# Altium schematic sheet LAB2.SchDoc: CAN-to-CAN
size A3; Revision: PW-Test-Lab2; PageSetup: Record=PageOptions|CenterHorizontal=True|CenterVertical=True|PrintScale=0.71|XCorrection=1.00|YCorrection=1.00|PrintKind=1|BorderSize=5000000|LeftOffset=0|BottomOffset=0|Orientation=2|PaperLength=2970|PaperWidth=2100|Scale=100|PaperSource=7|PrintQuality=1200|MediaType=1|DitherType=10|PaperKind=A4|PrintScaleMode=1
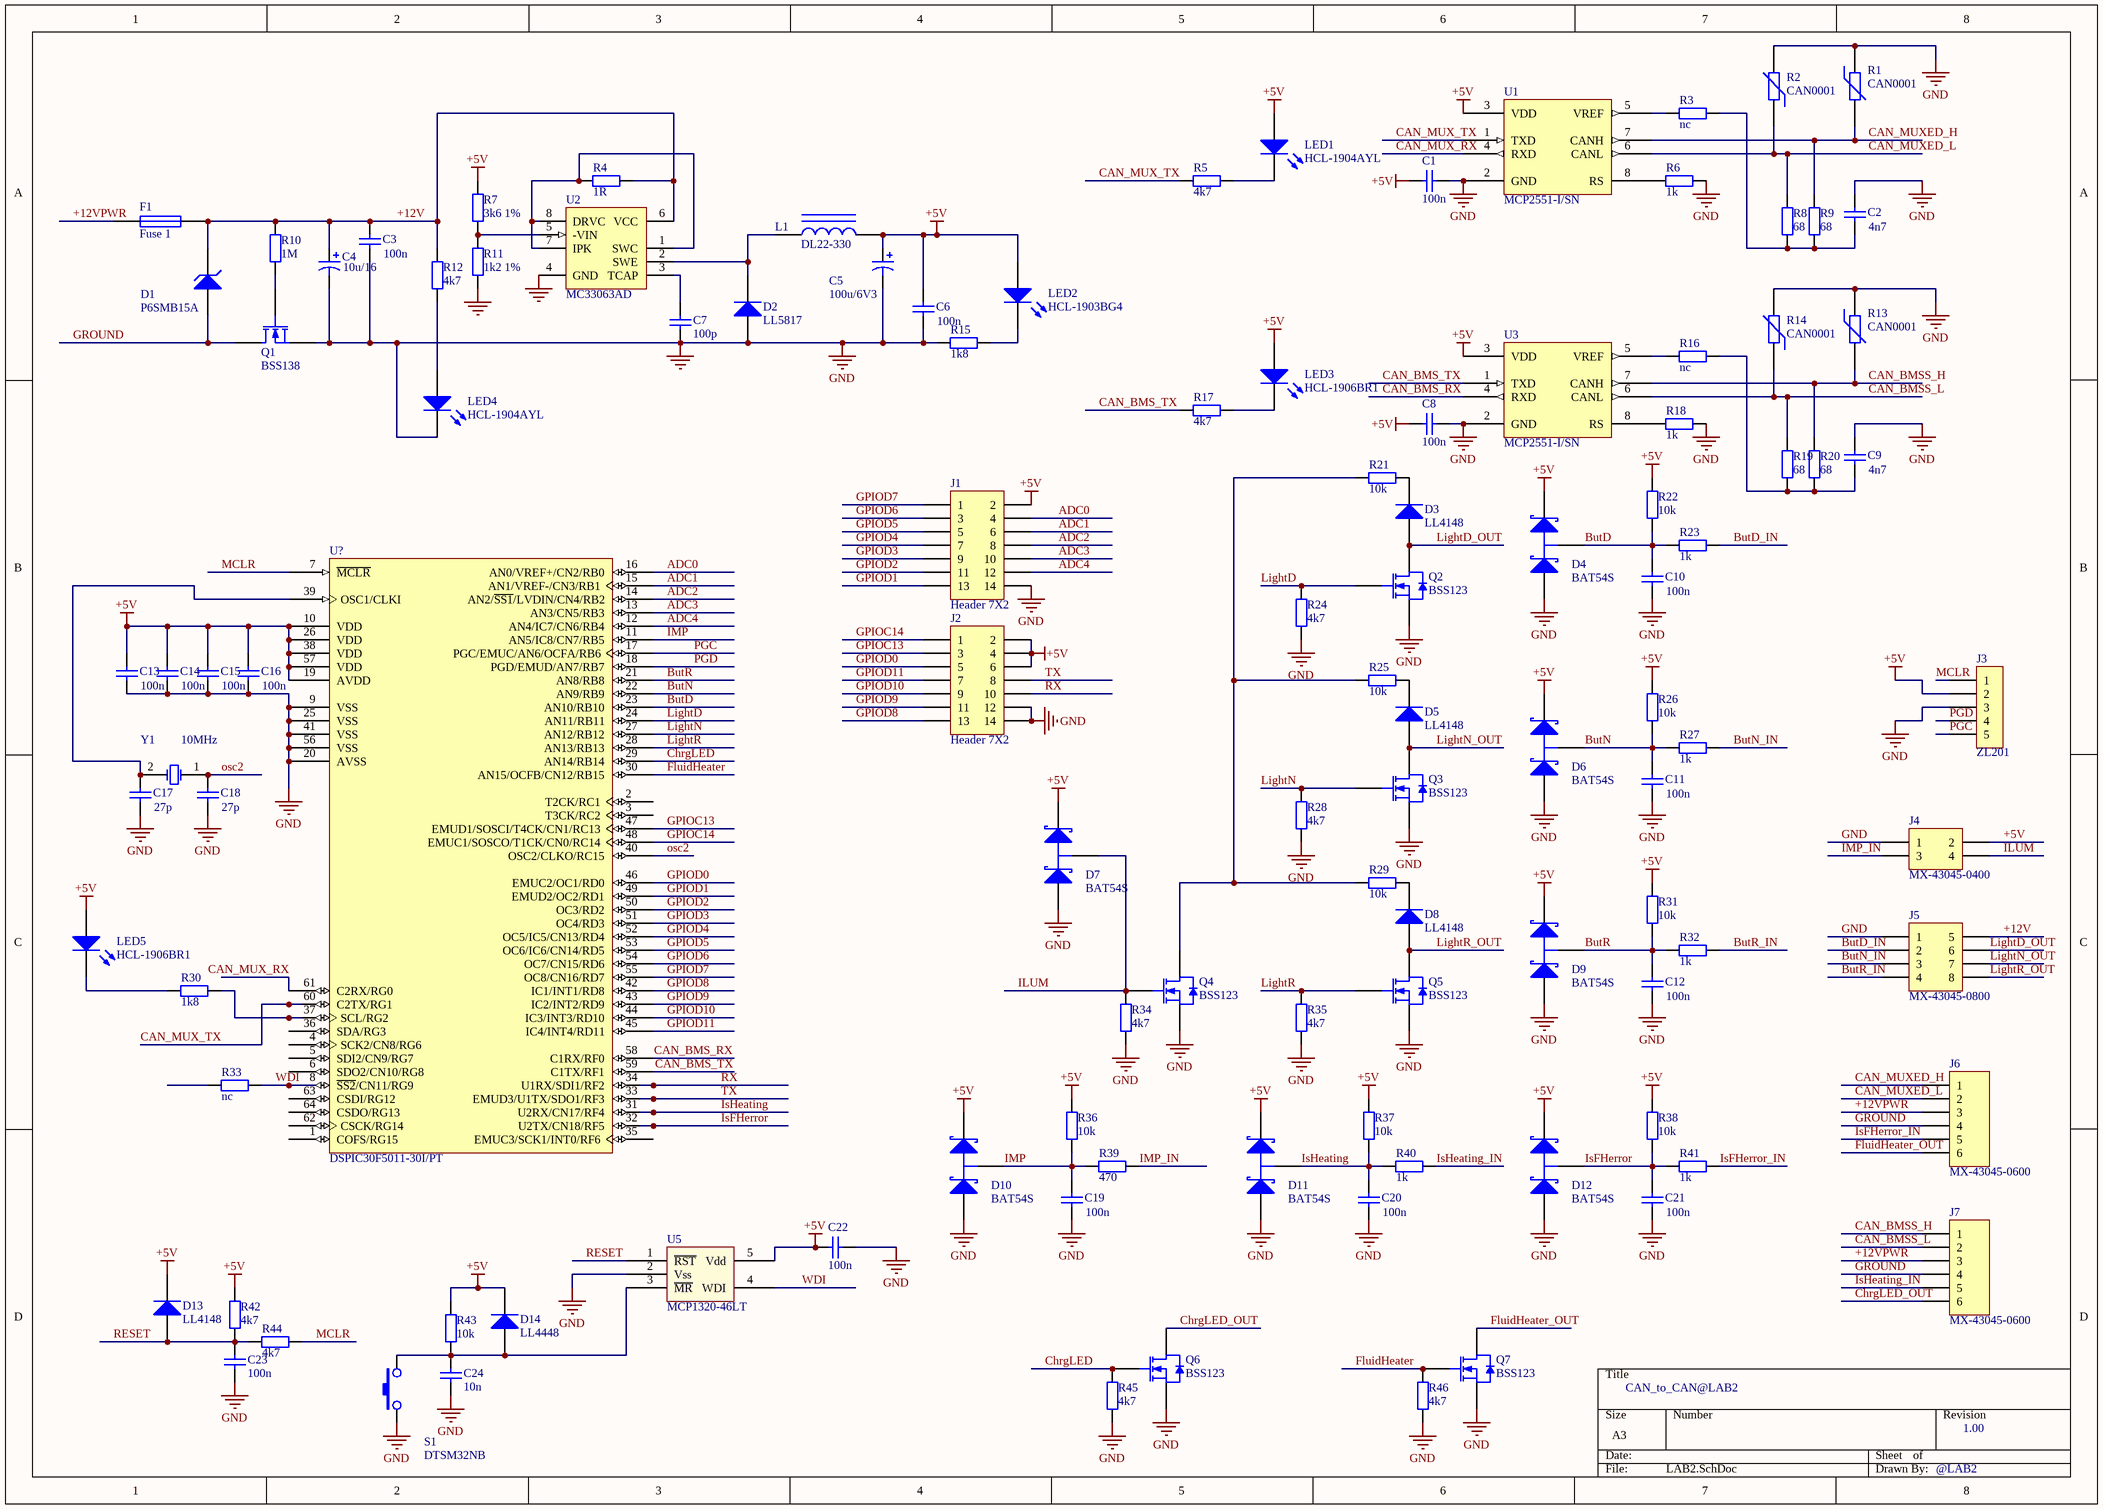
[diagram p0: LAB2.SchDoc]

## Parts
C1  100n  [0603]
C2  4n7  [0603]
C3  100n  [0805]
C4  10u/16  [CAP B]
C5  100u/6V3  [CAP B]
C6  100n  [0603]
C7  100p  [0603]
C8  100n  [0603]
C9  4n7  [0603]
C10  100n  [0603]
C11  100n  [0603]
C12  100n  [0603]
C13  100n  [0603]
C14  100n  [0603]
C15  100n  [0603]
C16  100n  [0603]
C17  27p  [0603]
C18  27p  [0603]
C19  100n  [0603]
C20  100n  [0603]
C21  100n  [0603]
C22  100n  [0603]
C23  100n  [0603]
C24  10n  [0603]
D1  P6SMB15A  [SMB]
D2  LL5817  [MELF]
D3  LL4148  [MINIMELF]
D4  BAT54S  [SOT-23]
D5  LL4148  [MINIMELF]
D6  BAT54S  [SOT-23]
D7  BAT54S  [SOT-23]
D8  LL4148  [MINIMELF]
D9  BAT54S  [SOT-23]
D10  BAT54S  [SOT-23]
D11  BAT54S  [SOT-23]
D12  BAT54S  [SOT-23]
D13  LL4148  [MINIMELF]
D14  LL4448  [MINIMELF]
F1  Fuse 1  [1812]
J1  Header 7X2  [HDR2X7]
J2  Header 7X2  [HDR2X7]
J3  ZL201  [HDR1X5]
J4  MX-43045-0400  [FP-43045-0400-MFG]
J5  MX-43045-0800  [MOLEX2X4]
J6  MX-43045-0600  [MOLEX2X3]
J7  MX-43045-0600  [MOLEX2X3]
L1  DL22-330  [DL22]
LED1  HCL-1904AYL  [0603]
LED2  HCL-1903BG4  [0603]
LED3  HCL-1906BR1  [0603]
LED4  HCL-1904AYL  [0603]
LED5  HCL-1906BR1  [0603]
Q1  BSS138  [SOT23]
Q2  BSS123  [SOT23]
Q3  BSS123  [SOT23]
Q4  BSS123  [SOT23]
Q5  BSS123  [SOT23]
Q6  BSS123  [SOT23]
Q7  BSS123  [SOT23]
R1  CAN0001  [0603]
R2  CAN0001  [0603]
R3  nc  [0603]
R4  1R  [0805]
R5  4k7  [0603]
R6  1k  [0603]
R7  3k6 1%  [0603]
R8  68  [0603]
R9  68  [0603]
R10  1M  [0603]
R11  1k2 1%  [0603]
R12  4k7  [0603]
R13  CAN0001  [0603]
R14  CAN0001  [0603]
R15  1k8  [0603]
R16  nc  [0603]
R17  4k7  [0603]
R18  1k  [0603]
R19  68  [0603]
R20  68  [0603]
R21  10k  [0603]
R22  10k  [0603]
R23  1k  [0603]
R24  4k7  [0603]
R25  10k  [0603]
R26  10k  [0603]
R27  1k  [0603]
R28  4k7  [0603]
R29  10k  [0603]
R30  1k8  [0603]
R31  10k  [0603]
R32  1k  [0603]
R33  nc  [0603]
R34  4k7  [0603]
R35  4k7  [0603]
R36  10k  [0603]
R37  10k  [0603]
R38  10k  [0603]
R39  470  [0603]
R40  1k  [0603]
R41  1k  [0603]
R42  4k7  [0603]
R43  10k  [0603]
R44  4k7  [0603]
R45  4k7  [0603]
R46  4k7  [0603]
S1  DTSM32NB  [DTSM31N]
U1  MCP2551-I/SN  [MCHP-SN8_V]
U2  MC33063AD  [SO8_N]
U3  MCP2551-I/SN  [MCHP-SN8_V]
U5  MCP1320-46LT  [SOT-23-OT5_L]
U?  DSPIC30F5011-30I/PT  [TQFP-PT64_L]
Y1  10MHz  [XTALSMD2]

## Nets
+5V: C1.1 C5.1 C6.1 C8.1 C13.1 C14.1 C15.1 C16.1 C22.1 D4.2(K) D6.2(K) D7.2(K) D9.2(K) D10.2(K) D11.2(K) D12.2(K) D13.2(K) D14.2(K) J1.2 J2.2 J2.4 J2.6 J3.2 J4.2 L1.2 LED1.1(A) LED2.1(A) LED3.1(A) LED5.1(A) R7.1 R22.1 R26.1 R31.1 R36.1 R37.1 R38.1 R42.1 R43.2 U1.3(VDD) U3.3(VDD) U5.5(Vdd) U?.10(VDD) U?.19(AVDD) U?.26(VDD) U?.38(VDD) U?.57(VDD)
GND: C1.2 C2.1 C3.2 C4.2 C5.2 C6.2 C7.1 C8.2 C9.1 C10.2 C11.2 C12.2 C13.2 C14.2 C15.2 C16.2 C17.2 C18.2 C19.2 C20.2 C21.2 C22.2 C23.1 C24.1 D2.1(A) D4.1(A) D6.1(A) D7.1(A) D9.1(A) D10.1(A) D11.1(A) D12.1(A) J1.14 J2.12 J2.14 J3.3 J4.1 J5.1 LED4.2(K) Q1.2(S) Q2.2(S) Q3.2(S) Q4.2(S) Q5.2(S) Q6.2(S) Q7.2(S) R1.1 R2.2 R6.2 R11.1 R13.1 R14.2 R15.2 R18.2 R24.2 R28.2 R34.2 R35.2 R45.2 R46.2 S1.1 U1.2(GND) U2.4(GND) U3.2(GND) U5.2(Vss) U?.9(VSS) U?.20(AVSS) U?.25(VSS) U?.41(VSS) U?.56(VSS)
+12V: C3.1 C4.1 D1.2(K) F1.2 J5.5 R4.2 R10.1 R12.1 U2.6(VCC)
+12VPWR: F1.1 J6.3 J7.3
ADC0: J1.4 U?.16(AN0/VREF+/CN2/RB0)
ADC1: J1.6 U?.15(AN1/VREF-/CN3/RB1)
ADC2: J1.8 U?.14(AN2/~{SS1}/LVDIN/CN4/RB2)
ADC3: J1.10 U?.13(AN3/CN5/RB3)
ADC4: J1.12 U?.12(AN4/IC7/CN6/RB4)
ButD: C10.1 D4.3(C) R22.2 R23.2 U?.23(AN10/RB10)
ButD_IN: J5.2 R23.1
ButN: C11.1 D6.3(C) R26.2 R27.2 U?.22(AN9/RB9)
ButN_IN: J5.3 R27.1
ButR: C12.1 D9.3(C) R31.2 R32.2 U?.21(AN8/RB8)
ButR_IN: J5.4 R32.1
CAN_BMS_RX: U3.4(RXD) U?.58(C1RX/RF0)
CAN_BMS_TX: R17.2 U3.1(TXD) U?.59(C1TX/RF1)
CAN_BMSS_H: J7.1 R13.2 R20.1 U3.7(CANH)
CAN_BMSS_L: J7.2 R14.1 R19.1 U3.6(CANL)
CAN_MUX_RX: U1.4(RXD)
CAN_MUX_TX: R5.2 U1.1(TXD) U?.60(C2TX/RG1)
CAN_MUXED_H: J6.1 R1.2 R9.1 U1.7(CANH)
CAN_MUXED_L: J6.2 R2.1 R8.1 U1.6(CANL)
ChrgLED: Q6.3(G) R45.1 U?.29(AN14/RB14)
ChrgLED_OUT: J7.6 Q6.1(D)
FluidHeater: Q7.3(G) R46.1 U?.30(AN15/OCFB/CN12/RB15)
FluidHeater_OUT: J6.6 Q7.1(D)
GPIOC13: J2.3 U?.47(EMUD1/SOSCI/T4CK/CN1/RC13)
GPIOC14: J2.1 U?.48(EMUC1/SOSCO/T1CK/CN0/RC14)
GPIOD0: J2.5 U?.46(EMUC2/OC1/RD0)
GPIOD1: J1.13 U?.49(EMUD2/OC2/RD1)
GPIOD2: J1.11 U?.50(OC3/RD2)
GPIOD3: J1.9 U?.51(OC4/RD3)
GPIOD4: J1.7 U?.52(OC5/IC5/CN13/RD4)
GPIOD5: J1.5 U?.53(OC6/IC6/CN14/RD5)
GPIOD6: J1.3 U?.54(OC7/CN15/RD6)
GPIOD7: J1.1 U?.55(OC8/CN16/RD7)
GPIOD8: J2.13 U?.42(IC1/INT1/RD8)
GPIOD9: J2.11 U?.43(IC2/INT2/RD9)
GPIOD10: J2.9 U?.44(IC3/INT3/RD10)
GPIOD11: J2.7 U?.45(IC4/INT4/RD11)
GROUND: D1.1(A) J6.4 J7.4 Q1.1(D)
ILUM: D7.3(C) J4.4 Q4.3(G) R34.1
IMP: C19.1 D10.3(C) R36.2 R39.2 U?.11(AN5/IC8/CN7/RB5)
IMP_IN: J4.3 R39.1
IsFHerror: C21.1 D12.3(C) R38.2 R41.2 U?.32(U2TX/CN18/RF5)
IsFHerror_IN: J6.5 R41.1
IsHeating: C20.1 D11.3(C) R37.2 R40.2 U?.31(U2RX/CN17/RF4)
IsHeating_IN: J7.5 R40.1
LightD: Q2.3(G) R24.1 U?.24(AN11/RB11)
LightD_OUT: D3.1(A) J5.6 Q2.1(D)
LightN: Q3.3(G) R28.1 U?.27(AN12/RB12)
LightN_OUT: D5.1(A) J5.7 Q3.1(D)
LightR: Q5.3(G) R35.1 U?.28(AN13/RB13)
LightR_OUT: D8.1(A) J5.8 Q5.1(D)
MCLR: J3.1 R44.1 U?.7(~{MCLR})
osc2: C18.1 U?.40(OSC2/CLKO/RC15) Y1.1(OSC1)
PGC: J3.5 U?.17(PGC/EMUC/AN6/OCFA/RB6)
PGD: J3.4 U?.18(PGD/EMUD/AN7/RB7)
RESET: C23.2 D13.1(A) R42.2 R44.2 U5.1(~{RST})
RX: J2.10 U?.34(U1RX/SDI1/RF2)
TX: J2.8 U?.33(EMUD3/U1TX/SDO1/RF3)
WDI: R33.1 U5.4(WDI) U?.8(~{SS2}/CN11/RG9)
NetC2_2: C2.2 R3.2 R8.2 R9.2
NetC7_2: C7.2 U2.3(TCAP)
NetC9_2: C9.2 R16.2 R19.2 R20.2
NetC17_1: C17.1 U?.39(OSC1/CLKI) Y1.2(OSC2)
NetC24_2: C24.2 D14.1(A) R43.1 S1.2 U5.3(~{MR})
NetD2_2: D2.2(K) L1.1 U2.2(SWE)
NetD3_2: D3.2(K) R21.2
NetD5_2: D5.2(K) R25.2
NetD8_2: D8.2(K) R29.2
NetLED1_2: LED1.2(K) R5.1
NetLED2_2: LED2.2(K) R15.1
NetLED3_2: LED3.2(K) R17.1
NetLED4_1: LED4.1(A) R12.2
NetLED5_2: LED5.2(K) R30.2
NetQ1_3: Q1.3(G) R10.2
NetQ4_1: Q4.1(D) R21.1 R25.1 R29.1
NetR3_1: R3.1 U1.5(VREF)
NetR4_1: R4.1 U2.1(SWC) U2.7(IPK) U2.8(DRVC)
NetR6_1: R6.1 U1.8(RS)
NetR7_2: R7.2 R11.2 U2.5(-VIN)
NetR16_1: R16.1 U3.5(VREF)
NetR18_1: R18.1 U3.8(RS)
NetR30_1: R30.1 U?.37(SCL/RG2)

Not connected (* = marked no-connect by the designer): R33 2; U? 1(COFS/RG15) 2(T2CK/RC1) 3(T3CK/RC2) 4(SCK2/CN8/RG6) 5(SDI2/CN9/RG7) 6(SDO2/CN10/RG8) 35(EMUC3/SCK1/INT0/RF6) 36(SDA/RG3) 61(C2RX/RG0) 62(CSCK/RG14) 63(CSDI/RG12) 64(CSDO/RG13)

## Notes on the sheet
- CAN_to_CAN@LAB2
- 1.00
- @LAB2
- Labels drawn without touching a wire or pin: CAN_MUX_RX

## Library data of the parts
C1 C3 C6 C8 C10-C16 C19-C23 = Cap: Capacitor; Published: 8-Jun-2000; LatestRevisionDate: 17-Jul-2002; LatestRevisionNote: Re-released for DXP Platform.; PackageReference: RAD-0.3; Publisher: Altium Limited; Value: 100n
C2 C9 C17 C18 = Cap: Capacitor; Value: 100n; Published: 8-Jun-2000; LatestRevisionDate: 17-Jul-2002; LatestRevisionNote: Re-released for DXP Platform.; PackageReference: RAD-0.3; Publisher: Altium Limited
C4 C5 = Cap Pol1: Polarized Capacitor (Radial); Value: 470u/16; Published: 8-Jun-2000; LatestRevisionDate: 17-Jul-2002; LatestRevisionNote: Re-released for DXP Platform.; PackageReference: RB7.6-15; Publisher: Altium Limited
C7 C24 = Cap: Capacitor; Value: 100pF; Published: 8-Jun-2000; LatestRevisionDate: 17-Jul-2002; LatestRevisionNote: Re-released for DXP Platform.; PackageReference: RAD-0.3; Publisher: Altium Limited
D1 = D Zener: Zener Diode; Published: 8-Jun-2000; LatestRevisionDate: 17-Jul-2002; LatestRevisionNote: Re-released for DXP Platform.; PackageReference: DIODE-0.7; Publisher: Altium Limited
D2 D3 D5 D8 D13 = 1N4148: High Conductance Fast Diode; Published: 8-Jun-2000; LatestRevisionDate: 17-Jul-2002; LatestRevisionNote: Re-released for DXP Platform.; DatasheetDocument: 1997; PackageReference: DO-35; Publisher: Altium Limited; Code_JEDEC: DO-204-AH; ComponentLink1Description: Manufacturer Link; ComponentLink1URL: http://www.fairchildsemi.com/; ComponentLink2Description: Datasheet; ComponentLink2URL: http://www.fairchildsemi.com/ds/1N%2F1N4148.pdf
D4 D6 D7 D9-D12 = BAT54S: Schottky Barrier Double Diode; Published: 17-Sep-2003; LatestRevisionDate: 12-Dec-2006; LatestRevisionNote: IPC-7351 Footprint Added.; DatasheetVersion: 4-Mar-2002; PackageVersion: May-1999; PackageReference: SOT23; Publisher: Altium Limited; PackageDescription: 3-Pin SOT-23 Package 0.95 mm Pitch, 2.3 mm Lead Span; ComponentLink1Description: Manufacturer Link; ComponentLink1URL: http://www.semiconductors.philips.com/; ComponentLink2Description: Datasheet; ComponentLink2URL: http://www.semiconductors.philips.com/acrobat/datasheets/BAT54_SERIES_4.pdf
D14 = Diode: Default Diode; Published: 8-Jun-2000; LatestRevisionDate: 17-Jul-2002; LatestRevisionNote: Re-released for DXP Platform.; PackageDocument: Sep-1996; PackageReference: SMC; Publisher: Altium Limited; Code_JEDEC: DO-214-AB
F1 = Fuse 1: Fuse; Published: 8-Jun-2000; LatestRevisionDate: 17-Jul-2002; LatestRevisionNote: Re-released for DXP Platform.; PackageReference: PIN-W2/E2.8; Publisher: Altium Limited
J1 J2 = Header 7X2: Header, 7-Pin, Dual row; LatestRevisionDate: 17-Jul-2002; LatestRevisionNote: Re-released for DXP Platform.; Publisher: Altium Limited
J3 = CON5: Connector
J4 = Header 2X2: Header, 2-Pin, Dual row; LatestRevisionDate: 17-Jul-2002; LatestRevisionNote: Re-released for DXP Platform.; Publisher: Altium Limited
J5 = Header 4X2A: Header, 4-Pin, Dual row; LatestRevisionDate: 17-Jul-2002; LatestRevisionNote: Re-released for DXP Platform.; Publisher: Altium Limited
J6 J7 = Header 6: Header, 6-Pin; LatestRevisionDate: 17-Jul-2002; LatestRevisionNote: Re-released for DXP Platform.; Publisher: Altium Limited
L1 = Inductor Iron: Magnetic-Core Inductor; Value: 100uH; Published: 24-Mar-1999; Revision: July-2002: Re-released for DXP Platform.; Publisher: Altium Limited
LED1-LED5 = LED3: Typical BLUE SiC LED; Revision 1: Jul-2002: Re-released for DXP Platform.; Revision 2: 17-Dec-2003: PCB Footprint replaced.; Published: 8-Jun-2000; Publisher: Altium Limited
Q1 = BSS138: N-Channel Enhancement Mode Vertical DMOS FET; Published: 17-Dec-2003; DatasheetVersion: Mar-96; PackageVersion: 1996; PackageReference: SOT23; Publisher: Altium Limited; PackageDescription: SOT-23; 3 Leads; Body 3.1 x 2.5 mm, inc. leads (LxW max), Alternate Lead Configuration; ComponentLink1Description: Manufacturer Link; ComponentLink1URL: http://www.zetex.com/; ComponentLink2Description: Datasheet; ComponentLink2URL: www.zetex.com/3.0/pdf/BSS138.pdf
Q2-Q7 = BSS123: N-channel Enhancement Mode Vertical D-MOSFET; Published: 17-Sep-2003; LatestRevisionDate: 12-Dec-2006; LatestRevisionNote: IPC-7351 Footprint Added.; DatasheetVersion: Apr-1995; PackageVersion: May-1999; PackageReference: SOT23; Publisher: Altium Limited; PackageDescription: 3-Pin SOT-23 Package 0.95 mm Pitch, 2.3 mm Lead Span; ComponentLink1Description: Manufacturer Link; ComponentLink1URL: http://www.semiconductors.philips.com/; ComponentLink2Description: Datasheet; ComponentLink2URL: http://www.semiconductors.philips.com/acrobat/datasheets/BSS123_3.pdf
R1 R2 R13 R14 = Res Varistor: Varistor (Voltage-Sensitive Resistor); Published: 24-Mar-1999; LatestRevisionDate: 04-Mar-2005; LatestRevisionNote: PCB Footprint replaced.; PackageReference: 6-0805; Publisher: Altium Limited
R3-R5 R7-R12 R15-R17 R19-R22 R24-R26 R28-R31 R33-R39 R42-R46 = Res2: Resistor; Value: 1K; Published: 8-Jun-2000; LatestRevisionDate: 17-Jul-2002; LatestRevisionNote: Re-released for DXP Platform.; PackageReference: AXIAL-0.4; Publisher: Altium Limited
R6 R18 R23 R27 R32 R40 R41 = Res2: Resistor; Published: 8-Jun-2000; LatestRevisionDate: 17-Jul-2002; LatestRevisionNote: Re-released for DXP Platform.; PackageReference: AXIAL-0.4; Publisher: Altium Limited; Value: 1K
S1 = PUSHB: Switch PushButton
U1 U3 = MCP2551-I/SN: High Speed CAN Transceiver, 8-Pin Plastic SOIC, Industrial Grade; Published: 6-Oct-2005; LatestRevisionDate: 13-Apr-2006; LatestRevisionNote: IPC-7351 Footprint Added.; DatasheetVersion: Nov-2003; PackageVersion: Oct-2005; PackageReference: SOIC150-8; Publisher: Altium Limited; PackageDescription: 8-Pin Plastic Narrow Body Small Outline Integrated Circuit 1.27 mm Pitch; Code_JEDEC: MS-012; ComponentLink1Description: Manufacturer Link; ComponentLink1URL: http://www.microchip.com; ComponentLink2Description: Datasheet; ComponentLink2URL: http://ww1.microchip.com/downloads/en/DeviceDoc/21667d.pdf
U2 = MC33063AD: DC-to-DC Converter Control Circuit; Published: 17-Jul-2002; LatestRevisionDate: 13-Apr-2006; LatestRevisionNote: IPC-7351 Footprint Added.; DatasheetVersion: 1988; PackageReference: 751-02; Publisher: Altium Limited; PackageDescription: 8-Pin Small Outline Integrated Circuit 1.27 mm Pitch; Code_JEDEC: MS-012-AA; Code_IPC: SOIC127P600-8; ComponentLink1Description: Manufacturer Link; ComponentLink1URL: http://www.onsemi.com/site/products/taxonomy/0,4438,503,00.html; ComponentLink2Description: Datasheet; ComponentLink2URL: http://www.onsemi.com/pub/Collateral/MC34063A-D.PDF
U5 = MCP1320
U? = CMP-0044-00148-1: High-Performance 16-bit Digital Signal Controller, 66 KB Flash, 4 KB SRAM, 1 KB EEPROM, 64-Pin TQFP, Industrial Temperature; PackageDescription: 64-Lead Thin Plastic Quad Flat Pack (PT) - 10x10x1mm Body, 2.00mm [TQFP]; PackageReference: TQFP-PT64; PackageVersion: revBB, Aug-2009; DatasheetVersion: revH, Jun-2008; Code_JEDEC: MS-026
Y1 = XTAL: Crystal Oscillator; Published: 8-Jun-2000; LatestRevisionDate: 17-Jul-2002; LatestRevisionNote: Re-released for DXP Platform.; PackageReference: R38; Publisher: Altium Limited